# EAGLE design linpwr2 (EAGLE 5.08)
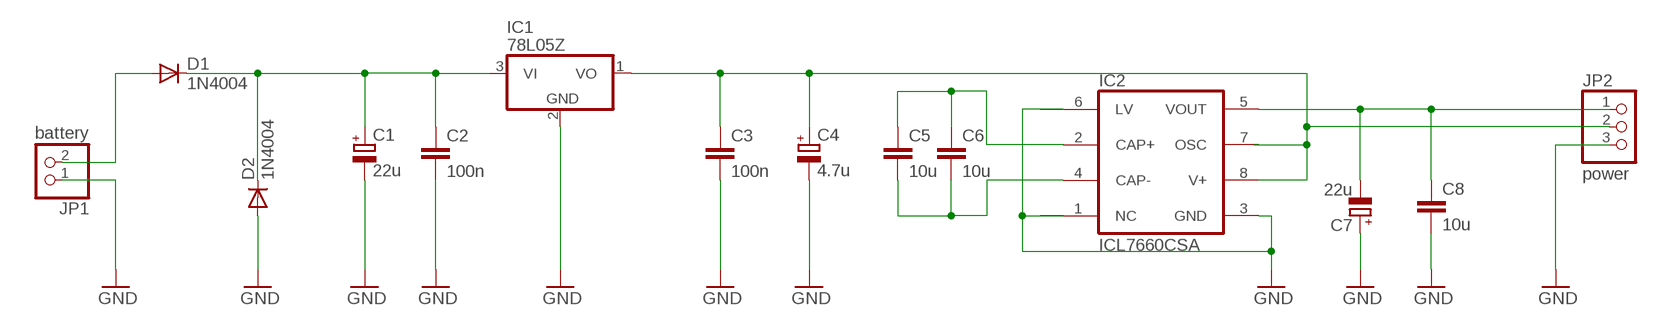
[diagram p0: schematic, sheet 1]

## Parts
C1  22u  CPOL-EUE2.5-6  [E2,5-6]
C2  100n  C-EUC1206K  [C1206K]
C3  100n  C-EUC1206K  [C1206K]
C4  4.7u  CPOL-EUE2.5-6  [E2,5-6]
C5  10u  C-EUC1206K  [C1206K]
C6  10u  C-EUC1206K  [C1206K]
C7  22u  CPOL-EUE2.5-6  [E2,5-6]
C8  10u  C-EUC1206K  [C1206K]
D1  1N4004  [DO41-10]
D2  1N4004  [DO41-10]
IC1  78L05Z  [TO92]
IC2  ICL7660CSA  [SO08]
JP1  battery  PINHD-1X2  [1X02]
JP2  power  PINHD-1X3  [1X03]

## Nets
GND: C1.- C2.2 C3.2 C4.- C7.+ C8.2 D2.A IC1.2(GND) IC2.1(NC) IC2.3(GND) IC2.6(LV) JP1.1 JP2.3
N$1: C1.+ C2.1 D1.C D2.C IC1.3(VI)
N$2: C5.2 C6.2 IC2.4(CAP-)
N$3: C5.1 C6.1 IC2.2(CAP+)
N$5: C7.- C8.1 IC2.5(VOUT) JP2.1
N$6: D1.A JP1.2
PWROUT: C3.1 C4.+ IC1.1(VO) IC2.7(OSC) IC2.8(V+) JP2.2

## Library data of the parts
C1 C4 C7 = rcl:CPOL-EU: POLARIZED CAPACITOR, European symbol
C2 C3 C5 C6 C8 = rcl:C-EU: CAPACITOR, European symbol
D1 D2 = diode:1N4004: DIODE general purpose rectifier, 1 A
IC1 = linear:78*: Positive VOLTAGE REGULATOR Source: http://cache.national.com/ds/LM/LM78L05.pdf http://www.fairchildsemi.com/ds/LM/LM7805.pdf
IC2 = maxim:ICL7660CSA: VOLTAGE CONVERTER
JP1 = pinhead:PINHD-1X2: PIN HEADER
JP2 = pinhead:PINHD-1X3: PIN HEADER

## Board
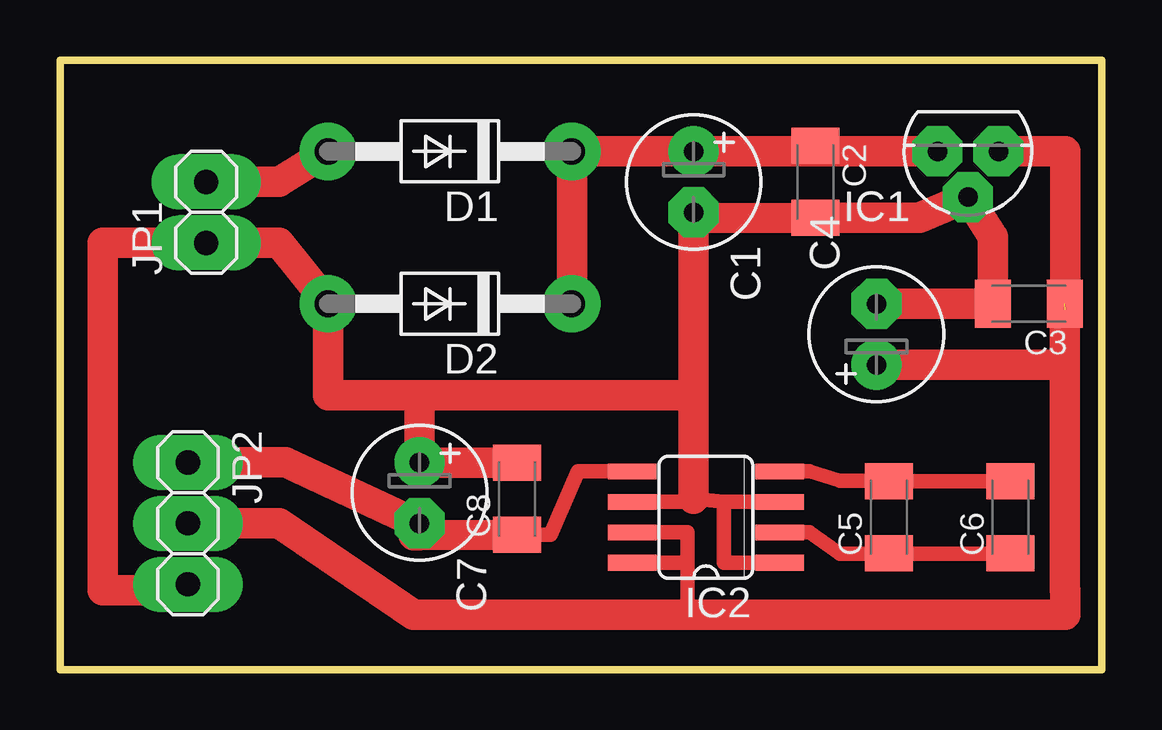
[diagram p1: board, top side]

Size 43.43 x 25.4 mm. Coordinates in mm from the lower left corner, seen from the top.
Outline: 0,25.4 0,0 43.43,0 43.43,25.4 0,25.4
Copper layers (1*16): Top 0.035mm / dielectric 1.5mm / Bottom 0.035mm
Design rules "default": minimum track width 8mil, minimum drill 32mil, track to track 8mil, track to pad 8mil, pad to pad 8mil, via to via 8mil, smd to smd 8mil, copper to edge 40mil, drill to drill 40mil, minimum pad ring 25mil, minimum via ring 12mil, stop-mask expansion 4mil, vias tented up to drill 0mil, thermal gap 10mil

### Footprints (pad centres in the part's own frame; a part is rotated, then mirrored left to right if it is on the bottom)
E2,5-6 = drill 0.813 pad 1.6 round: + -1.27,0 | drill 0.813 pad 1.6 octagon: - 1.27,0
C1206K = smd 1.5 x 2: 1 -1.5,0; 2 1.5,0
DO41-10 = drill 1.118 round: A 5.08,0; C -5.08,0
TO92 = drill 0.813 octagon: 1 -1.27,0; 2 0,1.905; 3 1.27,0
SO08 = smd 0.66 x 2.032: 1 -1.905,-3.073; 2 -0.635,-3.073; 3 0.635,-3.073; 4 1.905,-3.073; 5 1.905,3.073; 6 0.635,3.073; 7 -0.635,3.073; 8 -1.905,3.073
1X02 = drill 1.016 long: 1 -1.27,0; 2 1.27,0
1X03 = drill 1.016 long: 1 -2.54,0; 2 0,0; 3 2.54,0

### Placement (x,y rotation side)
C1  26.42,20.32 270 top
C2  31.5,20.32 270 top
C3  40.39,15.24 180 top
C4  34.04,13.97 90 top
C5  34.54,6.35 90 top
C6  39.62,6.35 90 top
C7  14.99,7.37 270 top
C8  19.05,7.11 90 top
D1  16.26,21.59 180 top
D2  16.26,15.24 180 top
IC1  37.85,21.59 180 top
IC2  26.92,6.35 90 top
JP1  6.1,19.05 90 top
JP2  5.33,6.1 270 top

### Tracks (layer width: path | path; a pad name or v marks a point on that pad's centre or on a via)
GND  (1 unrouted)
  Top 0.406: 5.33,3.3 JP2.3
  Top 0.61: IC2.1 27.69,4.45 27.69,6.99 | 27.69,6.99 IC2.3 | 26.54,6.99 IC2.6 | 26.42,7.11 27.69,6.99
  Top 1.27: 26.42,11.43 14.99,11.43 | 14.99,11.43 11.18,11.43 D2.A 9.14,17.78 JP1.1 1.78,17.78 1.78,3.3 5.33,3.3 | 26.42,11.43 C1.- 26.67,18.8 C2.2 35.81,18.82 IC1.2 38.89,18.03 C3.2 C4.- | 14.99,11.43 14.99,8.61 C8.2 | 26.42,11.43 26.42,7.11
N$1
  Top 1.27: D2.C D1.C C1.+ | IC1.3 C1.+ | C1.+ 31.5,21.59 C2.1
N$2
  Top 0.61: IC2.4 31.24,8.26 32.51,7.87 34.54,7.87 C5.2 C6.2
N$3
  Top 0.61: IC2.2 31.24,5.72 32.51,4.83 34.54,4.83 | C5.1 34.54,4.83 | 34.54,4.83 39.62,4.83 C6.1
N$5
  Top 0.61: C8.1 20.45,5.61 21.59,8.26 IC2.5
  Top 1.27: JP2.1 9.4,8.64 14.86,6.1 14.73,5.59 14.99,5.59 | C8.1 14.99,5.59 | C7.- 14.99,5.59
N$6
  Top 1.27: JP1.2 9.14,20.32 D1.A
PWROUT  (1 unrouted)
  Top 0.406: 41.89,3.3 41.91,3.3
  Top 0.61: IC2.7 26.16,5.72 26.16,4.45 | 26.16,4.45 IC2.8 | 26.16,2.29 26.16,4.45
  Top 1.27: IC1.1 41.91,21.59 41.91,14.99 | 41.89,12.7 C4.+ | C3.1 41.89,12.7 | 41.91,3.3 41.91,2.29 26.16,2.29 14.73,2.29 9.14,6.1 JP2.2 | 41.89,12.7 41.89,3.3